# EAGLE design csc (EAGLE 6.1)
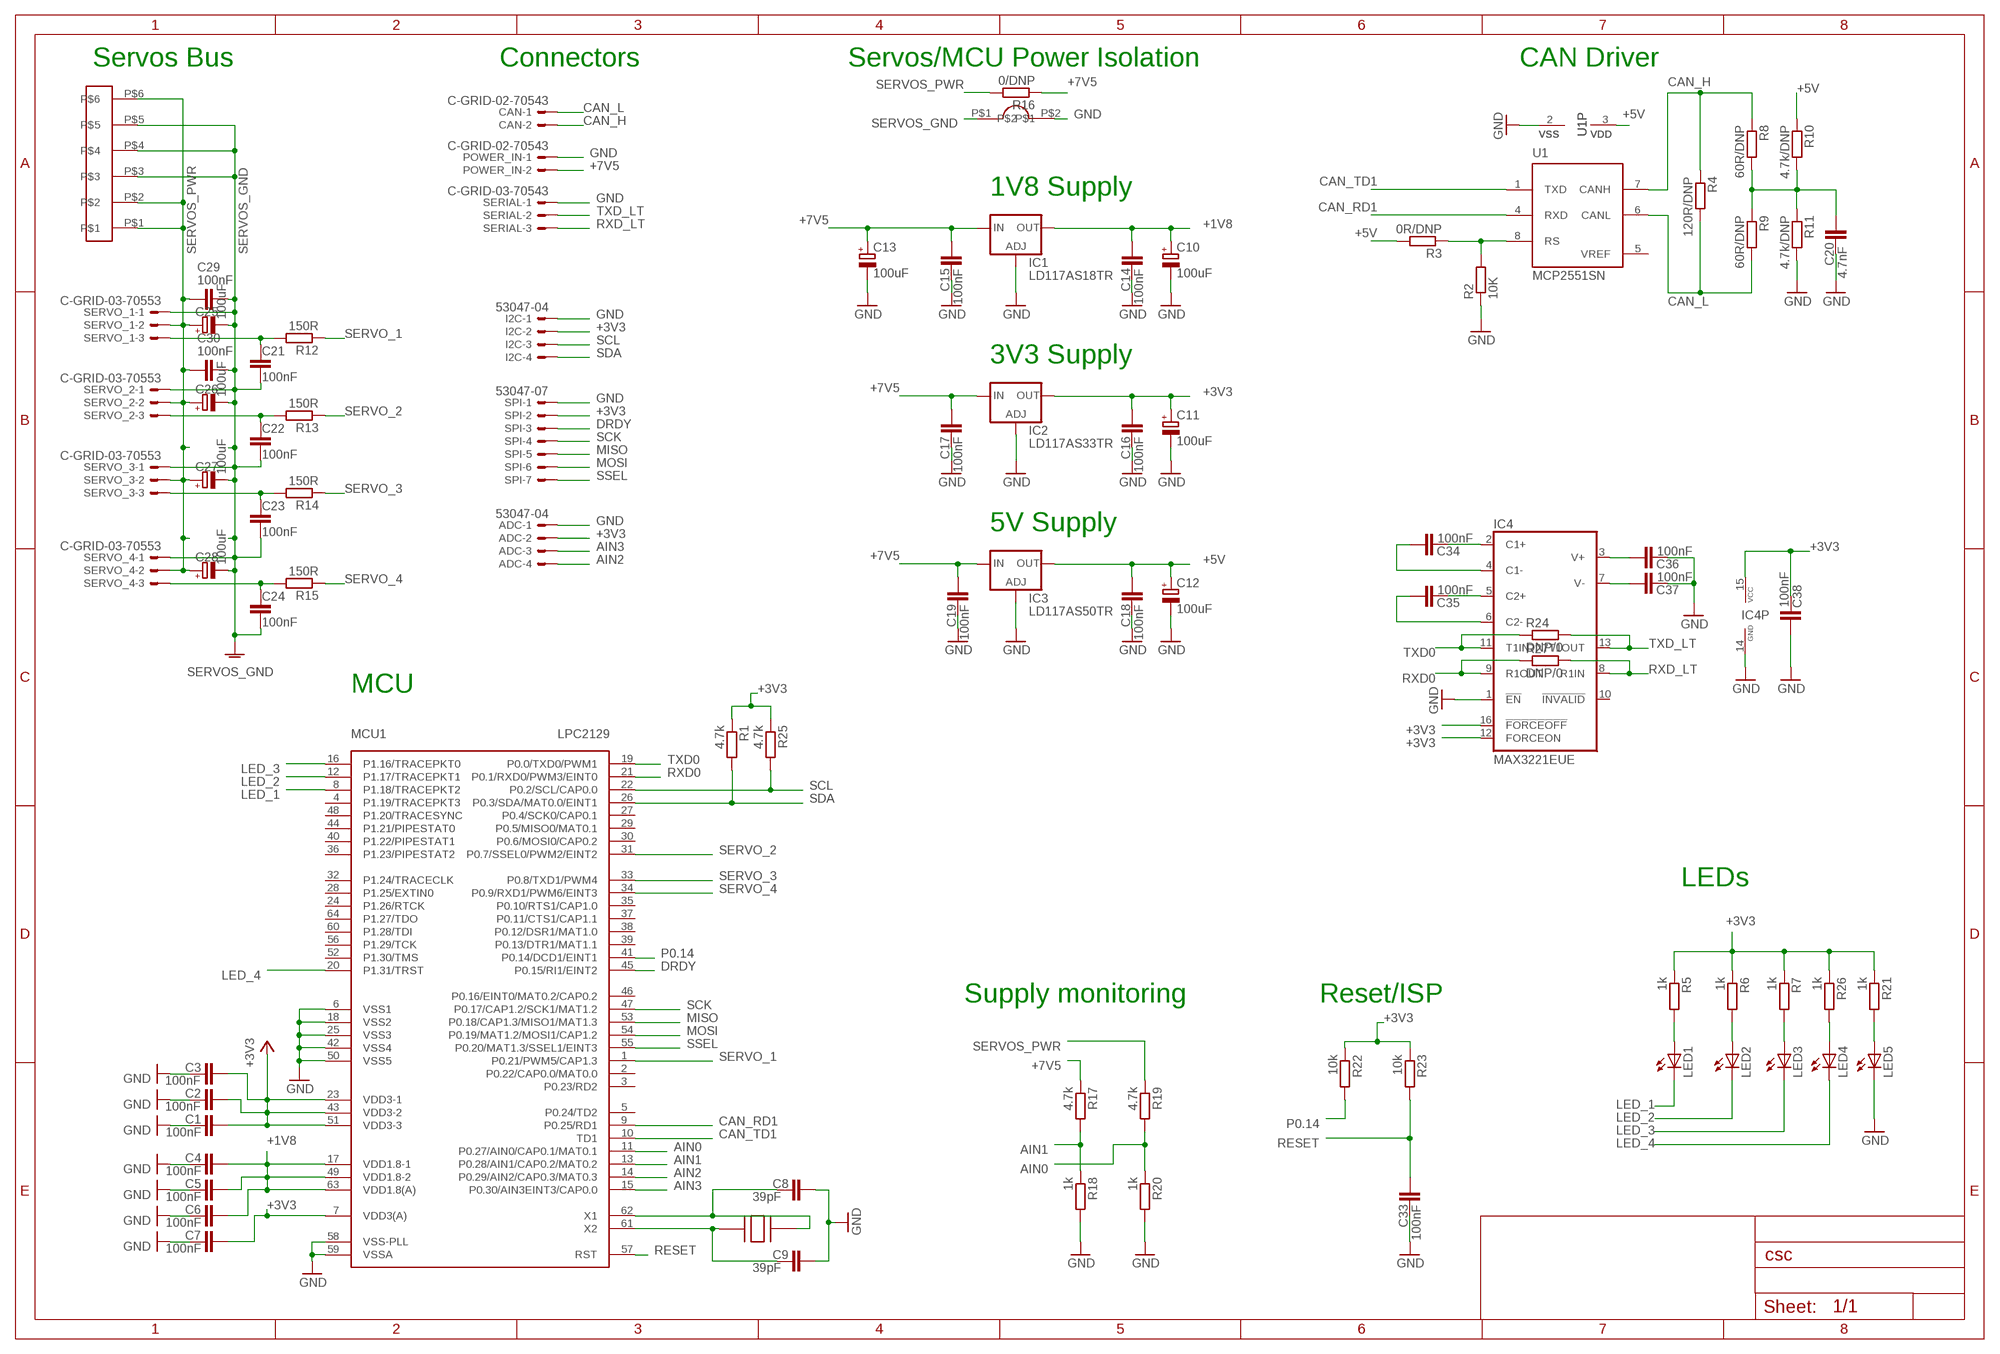
[diagram p0: schematic, sheet 1]

## Parts
ADC  53047-04  [53047-04]
C1  100nF  C-EUC0603K  [C0603K]
C2  100nF  C-EUC0603K  [C0603K]
C3  100nF  C-EUC0603K  [C0603K]
C4  100nF  C-EUC0603K  [C0603K]
C5  100nF  C-EUC0603K  [C0603K]
C6  100nF  C-EUC0603K  [C0603K]
C7  100nF  C-EUC0603K  [C0603K]
C8  39pF  C-EUC0603K  [C0603K]
C9  39pF  C-EUC0603K  [C0603K]
C10  100uF  CPOL-EUCT6032  [CT6032]
C11  100uF  CPOL-EUCT6032  [CT6032]
C12  100uF  CPOL-EUCT6032  [CT6032]
C13  100uF  CPOL-EUCT7343  [CT7343]
C14  100nF  C-EUC0603K  [C0603K]
C15  100nF  C-EUC0603K  [C0603K]
C16  100nF  C-EUC0603K  [C0603K]
C17  100nF  C-EUC0603K  [C0603K]
C18  100nF  C-EUC0603K  [C0603K]
C19  100nF  C-EUC0603K  [C0603K]
C20  4.7nF  C-EUC0603K  [C0603K]
C21  100nF  C-EUC0603K  [C0603K]
C22  100nF  C-EUC0603K  [C0603K]
C23  100nF  C-EUC0603K  [C0603K]
C24  100nF  C-EUC0603K  [C0603K]
C25  100uF  CPOL-EUE/7260-38W  [E/7260-38W]
C26  100uF  CPOL-EUE/7260-38W  [E/7260-38W]
C27  100uF  CPOL-EUE/7260-38W  [E/7260-38W]
C28  100uF  CPOL-EUE/7260-38W  [E/7260-38W]
C29  100nF  C-EUC0603K  [C0603K]
C30  100nF  C-EUC0603K  [C0603K]
C33  100nF  C-EUC0603K  [C0603K]
C34  100nF  C-EUC0603K  [C0603K]
C35  100nF  C-EUC0603K  [C0603K]
C36  100nF  C-EUC0603K  [C0603K]
C37  100nF  C-EUC0603K  [C0603K]
C38  100nF  C-EUC0603K  [C0603K]
CAN  C-GRID-02-70543  [70543-02]
I2C  53047-04  [53047-04]
IC1  LD117AS18TR  [SOT223]
IC2  LD117AS33TR  [SOT223]
IC3  LD117AS50TR  [SOT223]
IC4  MAX3221EUE  [TSSOP16]
LED1  LEDCHIP-LED0805  [CHIP-LED0805]
LED2  LEDCHIP-LED0805  [CHIP-LED0805]
LED3  LEDCHIP-LED0805  [CHIP-LED0805]
LED4  LEDCHIP-LED0805  [CHIP-LED0805]
LED5  LEDCHIP-LED0805  [CHIP-LED0805]
MCU1  LPC2129  [SQFP-S-10X10-64]
POWER_IN  C-GRID-02-70543  [70543-02]
R1  4.7k  R-EU_R0603  [R0603]
R2  10K  R-EU_R0603  [R0603]
R3  0R/DNP  R-EU_R0603  [R0603]
R4  120R/DNP  R-EU_R0603  [R0603]
R5  1k  R-EU_R0603  [R0603]
R6  1k  R-EU_R0603  [R0603]
R7  1k  R-EU_R0603  [R0603]
R8  60R/DNP  R-EU_R0603  [R0603]
R9  60R/DNP  R-EU_R0603  [R0603]
R10  4.7k/DNP  R-EU_R0603  [R0603]
R11  4.7k/DNP  R-EU_R0603  [R0603]
R12  150R  R-EU_R0603  [R0603]
R13  150R  R-EU_R0603  [R0603]
R14  150R  R-EU_R0603  [R0603]
R15  150R  R-EU_R0603  [R0603]
R16  0/DNP  R-EU_R0603  [R0603]
R17  4.7k  R-EU_R0603  [R0603]
R18  1k  R-EU_R0603  [R0603]
R19  4.7k  R-EU_R0603  [R0603]
R20  1k  R-EU_R0603  [R0603]
R21  1k  R-EU_R0603  [R0603]
R22  10k  R-EU_R0603  [R0603]
R23  10k  R-EU_R0603  [R0603]
R24  DNP/0  R-EU_R0603  [R0603]
R25  4.7k  R-EU_R0603  [R0603]
R26  1k  R-EU_R0603  [R0603]
R27  DNP/0  R-EU_R0603  [R0603]
SERIAL  C-GRID-03-70543  [70543-03]
SERVO_1  C-GRID-03-70553  [70553-03]
SERVO_2  C-GRID-03-70553  [70553-03]
SERVO_3  C-GRID-03-70553  [70553-03]
SERVO_4  C-GRID-03-70553  [70553-03]
SPI  53047-07  [53047-07]
U1  MCP2551SN  [SO-08]
U$1  CRYSTAL_CTS  [CTS_CRYSTAL]
U$2  CON_MPX  [CON_MPX]
U$3  NULL_DEV  [NULL_DEV]

## Nets
+1V8: C4.2 C5.2 C6.2 C10.+ C14.2 IC1.4(OUT) MCU1.17(VDD1.8-1) MCU1.49(VDD1.8-2) MCU1.63(VDD1.8(A))
+3V3: ADC.2 C1.2 C2.2 C3.2 C7.2 C11.+ C16.2 C38.1 I2C.2 IC2.4(OUT) IC4.12(FORCEON) IC4.15(VCC) IC4.16(!FORCEOFF) MCU1.7(VDD3(A)) MCU1.23(VDD3-1) MCU1.43(VDD3-2) MCU1.51(VDD3-3) R1.1 R5.1 R6.1 R7.1 R21.1 R22.1 R23.1 R25.1 R26.1 SPI.2
+5V: C12.+ C18.2 IC3.4(OUT) R3.2 R10.1 U1.3(VDD)
+7V5: C13.+ C15.2 C17.2 C19.2 IC1.3(IN) IC2.3(IN) IC3.3(IN) POWER_IN.2 R16.1 R17.1
AIN0: MCU1.11(P0.27/AIN0/CAP0.1/MAT0.1) R19.2 R20.1
AIN1: MCU1.13(P0.28/AIN1/CAP0.2/MAT0.2) R17.2 R18.1
AIN2: ADC.4 MCU1.14(P0.29/AIN2/CAP0.3/MAT0.3)
AIN3: ADC.3 MCU1.15(P0.30/AIN3EINT3/CAP0.0)
CAN_H: CAN.2 R4.1 R8.1 U1.7(CANH)
CAN_L: CAN.1 R4.2 R9.2 U1.6(CANL)
CAN_RD1: MCU1.9(P0.25/RD1) U1.4(RXD)
CAN_TD1: MCU1.10(TD1) U1.1(TXD)
DRDY: MCU1.45(P0.15/RI1/EINT2) SPI.3
GND: ADC.1 C1.1 C2.1 C3.1 C4.1 C5.1 C6.1 C7.1 C8.2 C9.2 C10.- C11.- C12.- C13.- C14.1 C15.1 C16.1 C17.1 C18.1 C19.1 C20.1 C33.1 C36.1 C37.1 C38.2 I2C.1 IC1.1(ADJ) IC2.1(ADJ) IC3.1(ADJ) IC4.1(!EN) IC4.14(GND) LED5.C MCU1.6(VSS1) MCU1.18(VSS2) MCU1.25(VSS3) MCU1.42(VSS4) MCU1.50(VSS5) MCU1.58(VSS-PLL) MCU1.59(VSSA) POWER_IN.1 R2.1 R11.2 R18.2 R20.2 SERIAL.1 SPI.1 U1.2(VSS) U$3.P$2
LED_1: LED1.C MCU1.8(P1.18/TRACEPKT2)
LED_2: LED2.C MCU1.12(P1.17/TRACEPKT1)
LED_3: LED3.C MCU1.16(P1.16/TRACEPKT0)
LED_4: LED4.C MCU1.20(P1.31/TRST)
MISO: MCU1.53(P0.18/CAP1.3/MISO1/MAT1.3) SPI.5
MOSI: MCU1.54(P0.19/MAT1.2/MOSI1/CAP1.2) SPI.6
N$1: C8.1 MCU1.62(X1) U$1.P$1
N$2: C9.1 MCU1.61(X2) U$1.P$3
N$3: R2.2 R3.1 U1.8(RS)
N$5: LED1.A R5.2
N$6: LED2.A R6.2
N$7: LED3.A R7.2
N$10: LED5.A R21.2
N$11: C20.2 R8.2 R9.1 R10.2 R11.1
N$12: C21.2 R12.2 SERVO_1.3
N$13: C22.2 R13.2 SERVO_2.3
N$14: C23.2 R14.2 SERVO_3.3
N$15: C24.2 R15.2 SERVO_4.3
N$16: C34.1 IC4.2(C1+)
N$17: LED4.A R26.2
N$18: C34.2 IC4.4(C1-)
N$19: C35.1 IC4.5(C2+)
N$20: C35.2 IC4.6(C2-)
N$26: C36.2 IC4.3(V+)
N$27: C37.2 IC4.7(V-)
P0.14: MCU1.41(P0.14/DCD1/EINT1) R22.2
RESET: C33.2 MCU1.57(RST) R23.2
RXD0: IC4.9(R1OUT) MCU1.21(P0.1/RXD0/PWM3/EINT0) R27.1
RXD_LT: IC4.8(R1IN) R27.2 SERIAL.3
SCK: MCU1.47(P0.17/CAP1.2/SCK1/MAT1.2) SPI.4
SCL: I2C.3 MCU1.22(P0.2/SCL/CAP0.0) R25.2
SDA: I2C.4 MCU1.26(P0.3/SDA/MAT0.0/EINT1) R1.2
SERVO_1: MCU1.1(P0.21/PWM5/CAP1.3) R12.1
SERVO_2: MCU1.31(P0.7/SSEL0/PWM2/EINT2) R13.1
SERVO_3: MCU1.33(P0.8/TXD1/PWM4) R14.1
SERVO_4: MCU1.34(P0.9/RXD1/PWM6/EINT3) R15.1
SERVOS_GND: C21.1 C22.1 C23.1 C24.1 C25.- C26.- C27.- C28.- C29.1 C30.1 SERVO_1.1 SERVO_2.1 SERVO_3.1 SERVO_4.1 U$2.P$3 U$2.P$4 U$2.P$5 U$3.P$1
SERVOS_PWR: C25.+ C26.+ C27.+ C28.+ C29.2 C30.2 R16.2 R19.1 SERVO_1.2 SERVO_2.2 SERVO_3.2 SERVO_4.2 U$2.P$1 U$2.P$2 U$2.P$6
SSEL: MCU1.55(P0.20/MAT1.3/SSEL1/EINT3) SPI.7
TXD0: IC4.11(T1IN) MCU1.19(P0.0/TXD0/PWM1) R24.1
TXD_LT: IC4.13(T1OUT) R24.2 SERIAL.2
Unconnected: IC4.10(!INVALID) MCU1.2(P0.22/CAP0.0/MAT0.0) MCU1.3(P0.23/RD2) MCU1.4(P1.19/TRACEPKT3) MCU1.5(P0.24/TD2) MCU1.24(P1.26/RTCK) MCU1.27(P0.4/SCK0/CAP0.1) MCU1.28(P1.25/EXTIN0) MCU1.29(P0.5/MISO0/MAT0.1) MCU1.30(P0.6/MOSI0/CAP0.2) MCU1.32(P1.24/TRACECLK) MCU1.35(P0.10/RTS1/CAP1.0) MCU1.36(P1.23/PIPESTAT2) MCU1.37(P0.11/CTS1/CAP1.1) MCU1.38(P0.12/DSR1/MAT1.0) MCU1.39(P0.13/DTR1/MAT1.1) MCU1.40(P1.22/PIPESTAT1) MCU1.44(P1.21/PIPESTAT0) MCU1.46(P0.16/EINT0/MAT0.2/CAP0.2) MCU1.48(P1.20/TRACESYNC) MCU1.52(P1.30/TMS) MCU1.56(P1.29/TCK) MCU1.60(P1.28/TDI) MCU1.64(P1.27/TDO)

## Notes on the sheet
- Servos Bus | Connectors | Servos/MCU Power Isolation | CAN Driver
- 1V8 Supply
- 3V3 Supply
- 5V Supply
- MCU
- LEDs
- Supply monitoring | Reset/ISP

## Power pins joined to a net without a drawn wire
VREF: U1.5(VREF)

## Library data of the parts
ADC I2C = con-molex:53?-04: CONNECTOR wire to board 1.25 mm (.049 inch) pitch header
C1-C9 C14-C24 C29 C30 C33-C38 = rcl:C-EU: CAPACITOR, European symbol
C10-C13 C25-C28 = rcl:CPOL-EU: POLARIZED CAPACITOR, European symbol
CAN POWER_IN = con-molex:C-GRID-02: CONNECTOR wire to board 2.54 mm (0.100") pitch header
IC1-IC3 = v-reg:LD117A?*: Low drop fixed and adjustable positive voltage regulators 1 A Source: http://www.st.com/stonline/products/literature/ds/7194/ld1117axx.pdf
IC4 = maxim:MAX3221*: RS-232 Transceivers with AutoShutdown 1µA Supply-Current, True +3V to +5.5V http://dbserv.maxim-ic.com/
LED1-LED5 = led:LED: LED OSRAM: - CHIPLED LG R971, LG N971, LY N971, LG Q971, LY Q971, LO R971, LY R971 LH N974, LH R974 LS Q976, LO Q976, LY Q976 LO Q996 - Hyper CHIPLED LW Q18S LB Q993, LB Q99A, LB R99A - SideLED LS A670, LO A670, LY A670, LG A670, LP A670 LB A673, LV A673, LT A673, LW A673 LH A674 LY A675 LS A676, LA A676, LO A676, LY A676, LW A676 LS A679, LY A679, LG A679 - Hyper Micro SIDELED® LS Y876, LA Y876, LO Y876, LY Y876 LT Y87S - SmartLED LW L88C, LW L88S LB L89C, LB L89S, LG L890 LS L89K, LO L89K, LY L89K LS L896, LA L896, LO L896, LY L896 - TOPLED LS T670, LO T670, LY T670, LG T670, LP T670 LSG T670, LSP T670, LSY T670, LOP T670, LYG T670 LG T671, LOG T671, LSG T671 LB T673, LV T673, LT T673, LW T673 LH T674 LS T676, LA T676, LO T676, LY T676, LB T676, LH T676, LSB T676, LW T676 LB T67C, LV T67C, LT T67C, LS T67K, LO T67K, LY T67K, LW E67C LS E67B, LA E67B, LO E67B, LY E67B, LB E67C, LV E67C, LT E67C LW T67C LS T679, LY T679, LG T679 LS T770, LO T770, LY T770, LG T770, LP T770 LB T773, LV T773, LT T773, LW T773 LH T774 LS E675, LA E675, LY E675, LS T675 LS T776, LA T776, LO T776, LY T776, LB T776 LHGB T686 LT T68C, LB T68C - Hyper Mini TOPLED® LB M676 - Mini TOPLED Santana® LG M470 LS M47K, LO M47K, LY M47K Source: http://www.osram.convergy.de LUXEON: - LUMILED® LXK2-PW12-R00, LXK2-PW12-S00, LXK2-PW14-U00, LXK2-PW14-V00 LXK2-PM12-R00, LXK2-PM12-S00, LXK2-PM14-U00 LXK2-PE12-Q00, LXK2-PE12-R00, LXK2-PE12-S00, LXK2-PE14-T00, LXK2-PE14-U00 LXK2-PB12-K00, LXK2-PB12-L00, LXK2-PB12-M00, LXK2-PB14-N00, LXK2-PB14-P00, LXK2-PB14-Q00 LXK2-PR12-L00, LXK2-PR12-M00, LXK2-PR14-Q00, LXK2-PR14-R00 LXK2-PD12-Q00, LXK2-PD12-R00, LXK2-PD12-S00 LXK2-PH12-R00, LXK2-PH12-S00 LXK2-PL12-P00, LXK2-PL12-Q00, LXK2-PL12-R00 Source: www.luxeon.com KINGBRIGHT: KA-3528ASYC Source: www.kingbright.com
MCU1 = paparazzi:LPC2129
R1-R27 = rcl:R-EU_: RESISTOR, European symbol
SERIAL SERVO_1-SERVO_4 = con-molex:C-GRID-03: CONNECTOR wire to board 2.54 mm (0.100") pitch header
SPI = con-molex:53?-07: CONNECTOR wire to board 1.25 mm (.049 inch) pitch header
U1 = microchip_can:MCP2551: High Speed CAN tranceiver
U$1 = paparazzi:CRYSTAL_CTS
U$2 = booz:CON_MPX
U$3 = booz:NULL_DEV

## Board
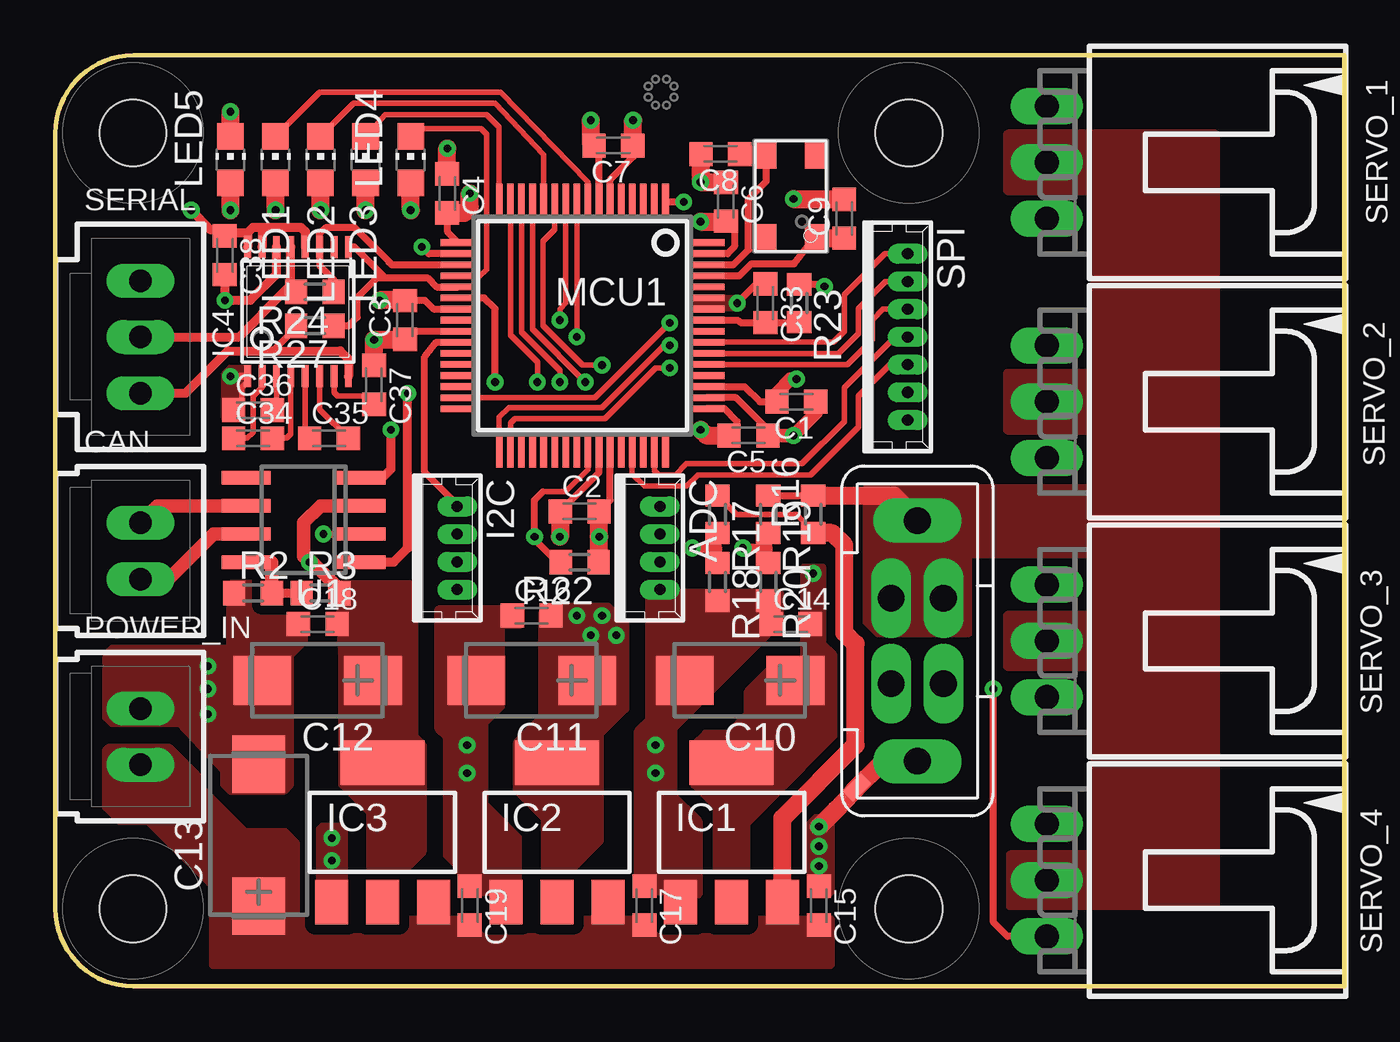
[diagram p1: board, top side]
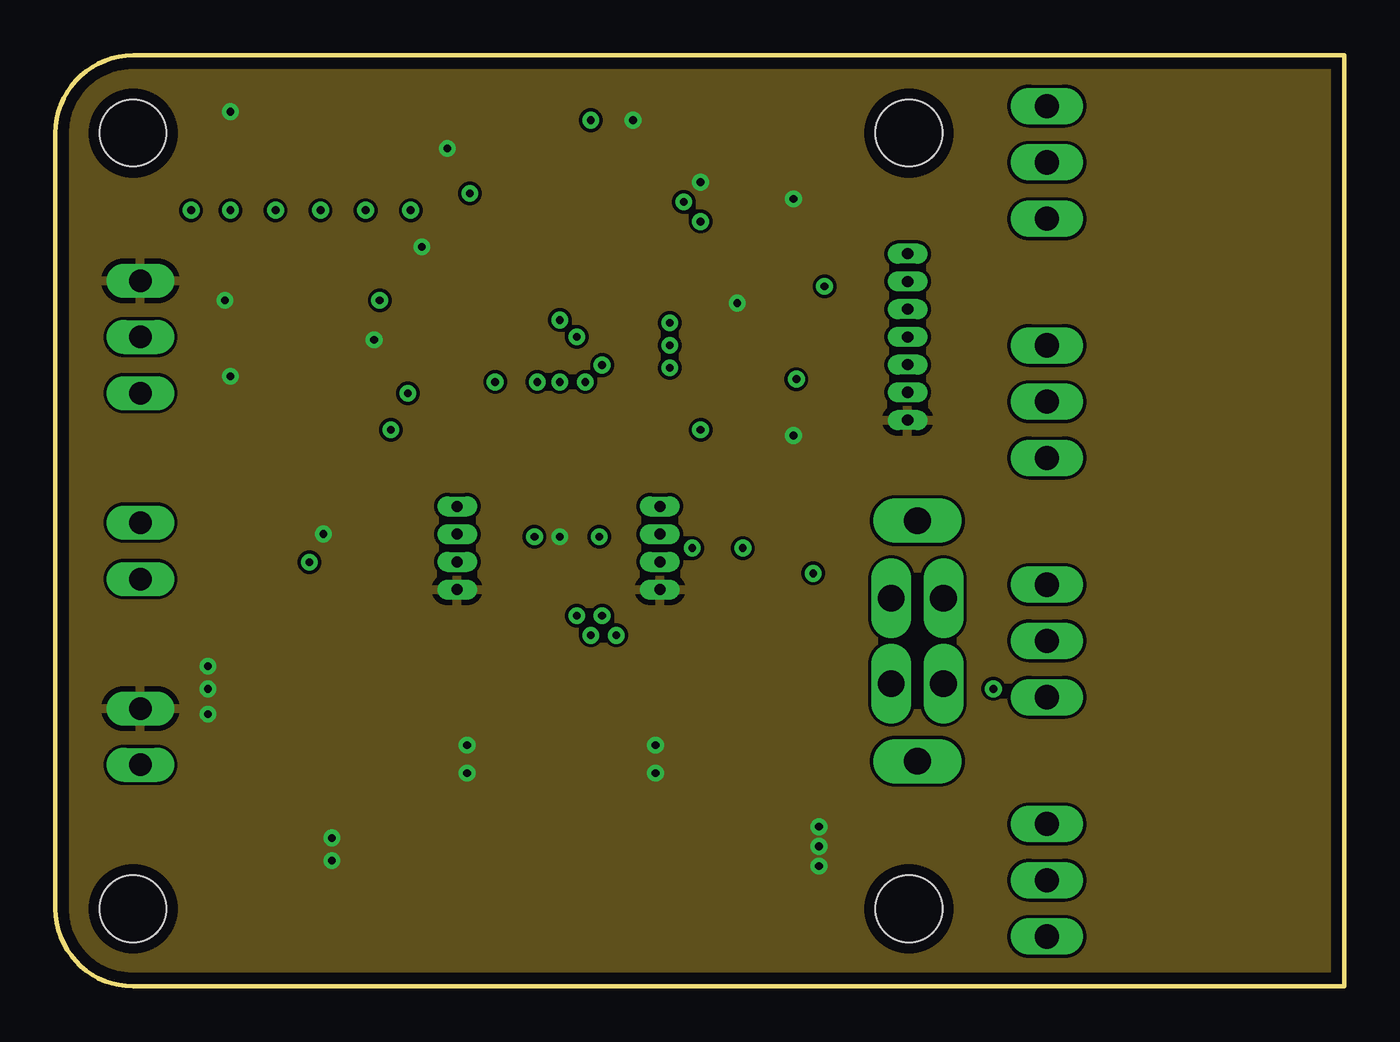
[diagram p2: board, inner layer Route2]
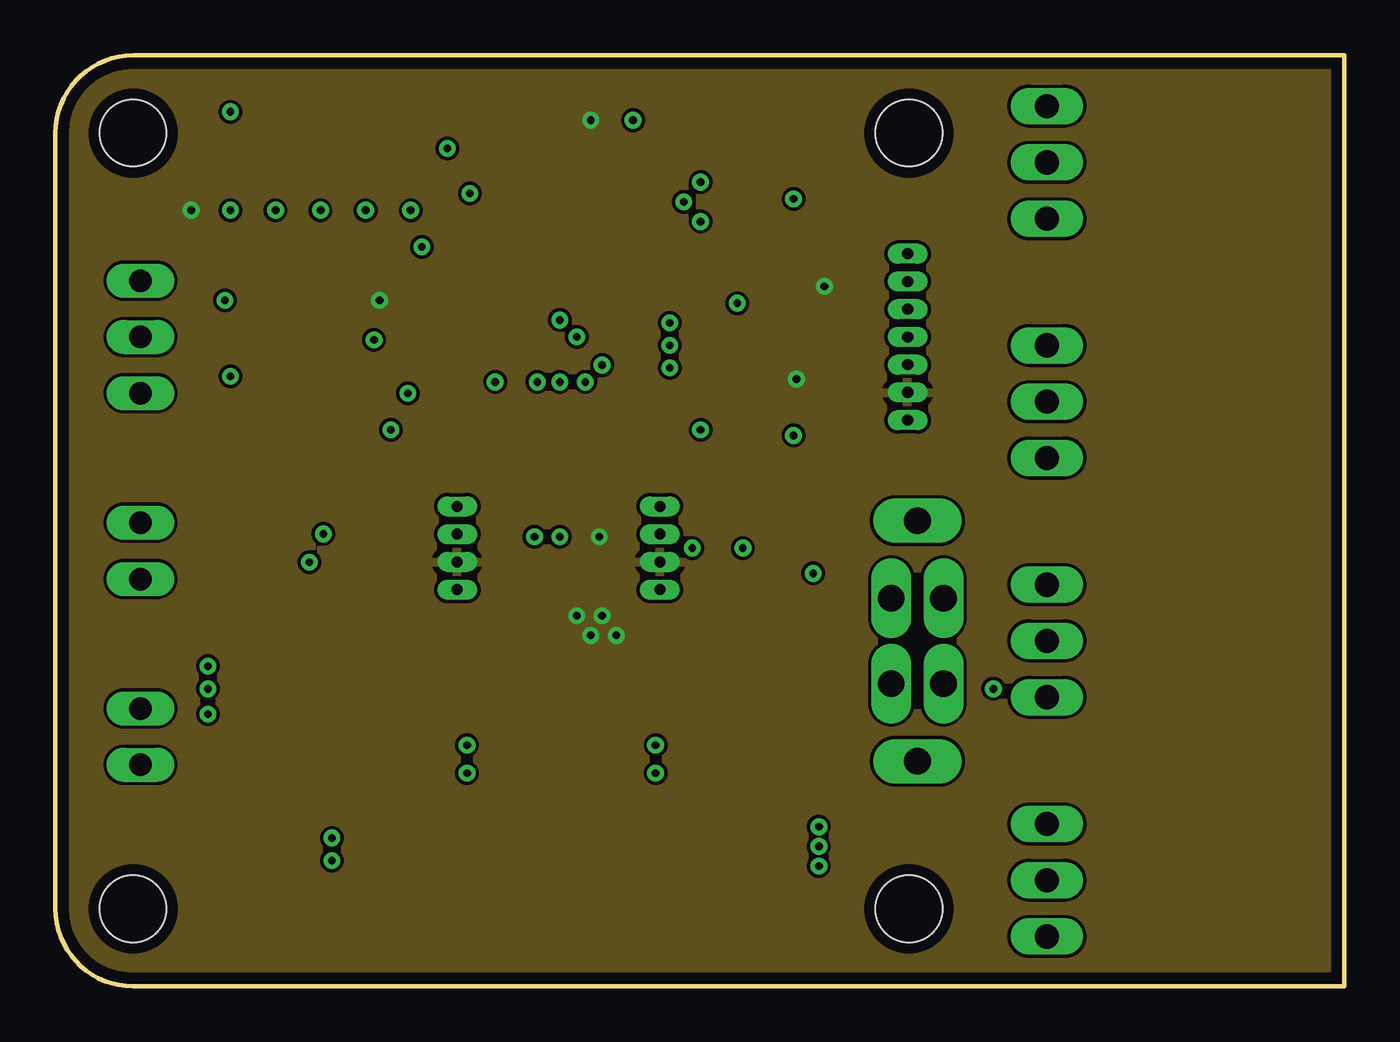
[diagram p3: board, inner layer Route15]
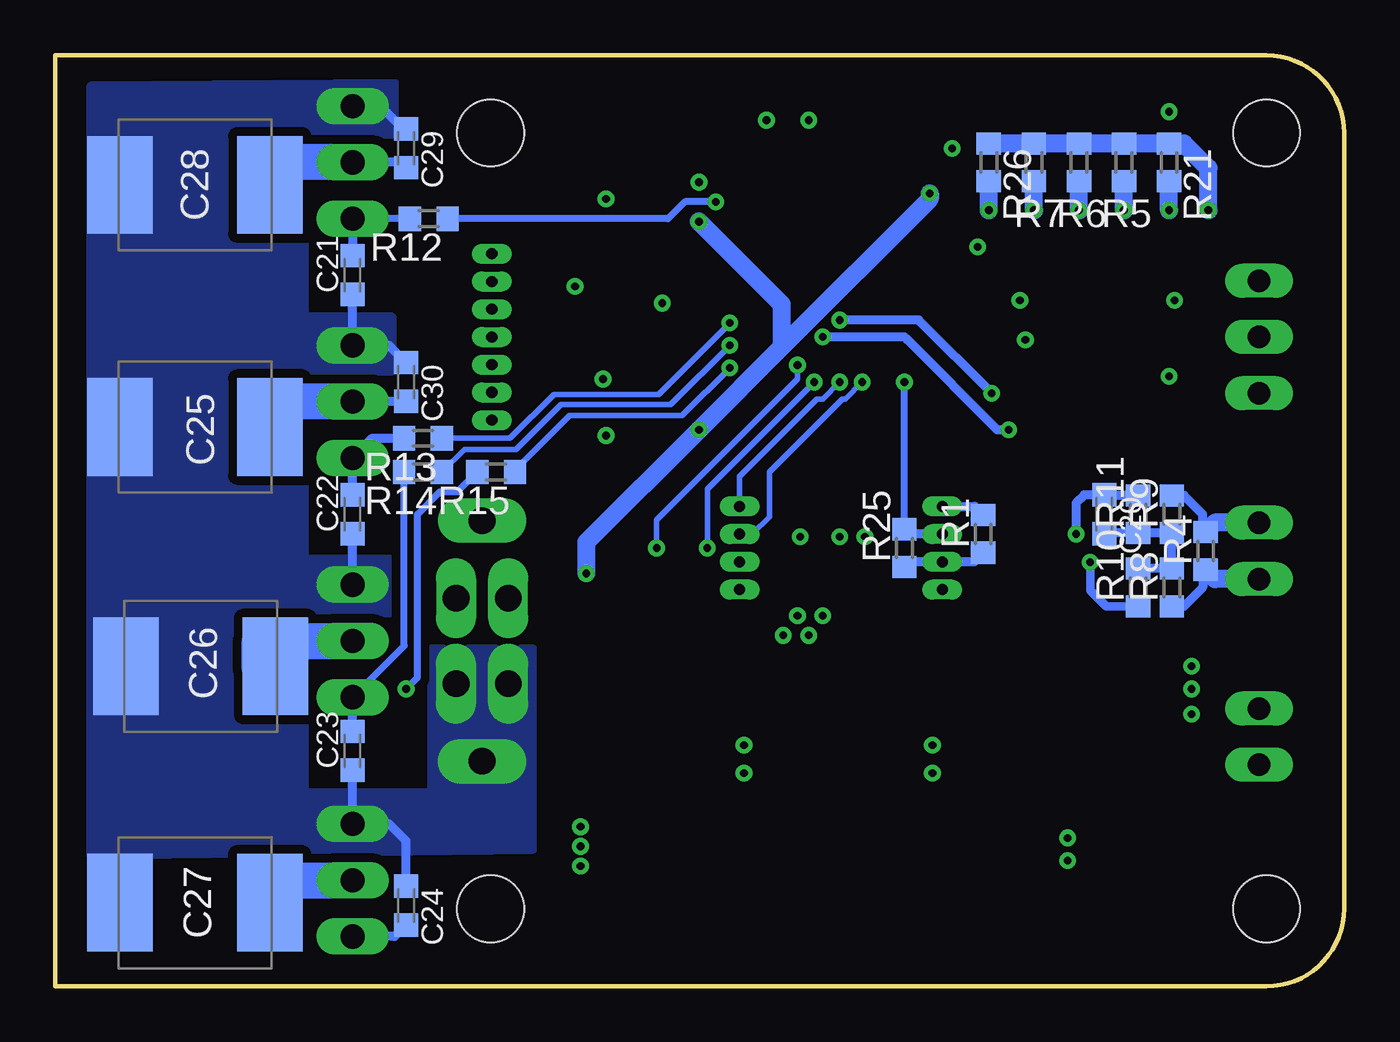
[diagram p4: board, bottom side, seen from below]

Size 58.13 x 42 mm. Coordinates in mm from the lower left corner, seen from the top.
Outline: 3.5,42 58.13,42 58.13,0 3.5,0 arc-90 0,3.5 0,38.5 arc-90 3.5,42
Copper layers (1+2*15+16): Top 0.0178mm / dielectric 12mil / Route2 0.0356mm / dielectric 28mil / Route15 0.0356mm / dielectric 12mil / Bottom 0.0178mm
Design rules: minimum track width 6mil, minimum drill 8mil, track to track 6mil, track to pad 6mil, pad to pad 6mil, via to via 6mil, smd to smd 6mil, copper to edge 20mil, drill to drill 16mil, minimum pad ring 8mil, minimum via ring 8mil, stop-mask expansion 3mil, vias tented up to drill 0.36mm, thermal gap 10mil
Holes 3 mm at 3.5,38.5 3.5,3.5 38.5,38.5 38.5,3.5
tKeepout: area 0,35 to 7,42; area 0,0 to 7,7; area 35,35 to 42,42; area 35,0 to 42,7

### Footprints (pad centres in the part's own frame; a part is rotated, then mirrored left to right if it is on the bottom)
53047-04 = drill 0.5 pad 0.698 long: 1 1.875,0.45; 2 0.625,0.45; 3 -0.625,0.45; 4 -1.875,0.45
C0603K = smd 1.05 x 1.08: 1 -0.875,0; 2 0.875,0
CT6032 = smd 2.6 x 2.2: + -2.5,0; - 2.5,0
CT7343 = smd 2.6 x 2.4: + -3.2,0; - 3.2,0
E/7260-38W = smd 2.95 x 4.4: + 3.375,0; - -3.375,0
70543-02 = drill 1.016 long: 1 -1.27,0; 2 1.27,0
SOT223 = smd 1.5 x 2: 1 -2.3,-3.15; 2 0,-3.15; 3 2.3,-3.15 | smd 3.8 x 2: 4 0,3.15
TSSOP16 = smd 0.305 x 0.991: 1 -2.275,-2.918; 2 -1.625,-2.918; 3 -0.975,-2.918; 4 -0.325,-2.918; 5 0.325,-2.918; 6 0.975,-2.918; 7 1.625,-2.918; 8 2.275,-2.918; 9 2.275,2.918; 10 1.625,2.918; 11 0.975,2.918; 12 0.325,2.918; 13 -0.325,2.918; 14 -0.975,2.918; 15 -1.625,2.918; 16 -2.275,2.918
CHIP-LED0805 = smd 1.2 x 1.2: A 0,-1.05; C 0,1.05
SQFP-S-10X10-64 = smd 0.3 x 1.6: 1 -3.75,-5.6; 2 -3.25,-5.6; 3 -2.75,-5.6; 4 -2.25,-5.6; 5 -1.75,-5.6; 6 -1.25,-5.6; 7 -0.75,-5.6; 8 -0.25,-5.6; 9 0.25,-5.6; 10 0.75,-5.6; 11 1.25,-5.6; 12 1.75,-5.6; 13 2.25,-5.6; 14 2.75,-5.6; 15 3.25,-5.6; 16 3.75,-5.6; 33 3.75,5.6; 34 3.25,5.6; 35 2.75,5.6; 36 2.25,5.6; 37 1.75,5.6; 38 1.25,5.6; 39 0.75,5.6; 40 0.25,5.6; 41 -0.25,5.6; 42 -0.75,5.6; 43 -1.25,5.6; 44 -1.75,5.6; 45 -2.25,5.6; 46 -2.75,5.6; 47 -3.25,5.6; 48 -3.75,5.6 | smd 1.6 x 0.3: 17 5.6,-3.75; 18 5.6,-3.25; 19 5.6,-2.75; 20 5.6,-2.25; 21 5.6,-1.75; 22 5.6,-1.25; 23 5.6,-0.75; 24 5.6,-0.25; 25 5.6,0.25; 26 5.6,0.75; 27 5.6,1.25; 28 5.6,1.75; 29 5.6,2.25; 30 5.6,2.75; 31 5.6,3.25; 32 5.6,3.75; 49 -5.6,3.75; 50 -5.6,3.25; 51 -5.6,2.75; 52 -5.6,2.25; 53 -5.6,1.75; 54 -5.6,1.25; 55 -5.6,0.75; 56 -5.6,0.25; 57 -5.6,-0.25; 58 -5.6,-0.75; 59 -5.6,-1.25; 60 -5.6,-1.75; 61 -5.6,-2.25; 62 -5.6,-2.75; 63 -5.6,-3.25; 64 -5.6,-3.75
R0603 = smd 1 x 1.1: 1 -0.85,0; 2 0.85,0
70543-03 = drill 1.016 long: 1 -2.54,0; 2 0,0; 3 2.54,0
70553-03 = drill 1.092 long: 1 -2.54,-7.62; 2 0,-7.62; 3 2.54,-7.62
53047-07 = drill 0.5 pad 0.698 long: 1 3.75,0.45; 2 2.5,0.45; 3 1.25,0.45; 4 0,0.45; 5 -1.25,0.45; 6 -2.5,0.45; 7 -3.75,0.45
SO-08 = smd 0.6 x 2.2: 1 -1.905,-2.6; 2 -0.635,-2.6; 3 0.635,-2.6; 4 1.905,-2.6; 5 1.905,2.6; 6 0.635,2.6; 7 -0.635,2.6; 8 -1.905,2.6
CTS_CRYSTAL = smd 1.2 x 0.9: P$1 -1.85,-1.1; P$2 1.85,-1.1; P$3 1.85,1.1; P$4 -1.85,1.1
CON_MPX = drill 1.2 pad 2 long: P$1 5.425,0; P$4 -5.425,0 | drill 1.2 pad 1.7 long: P$2 1.925,1.175; P$3 -1.925,1.175; P$5 -1.925,-1.175; P$6 1.925,-1.175
NULL_DEV = smd 0.635 x 0.635: P$1 -0.254,0; P$2 0.254,0

### Placement (x,y rotation side)
ADC  26.82,19.77 270 top
C1  33.42,26.38 180 top
C2  23.65,21.42 0 top
C3  15.77,30.06 90 top
C4  17.68,35.77 270 top
C5  31.27,24.85 180 top
C6  30.25,35.39 270 top
C7  25.17,37.93 180 top
C8  30,37.55 180 top
C9  35.58,34.63 90 top
C10  30.88,13.8 180 top
C11  21.49,13.8 180 top
C12  11.84,13.8 180 top
C13  9.17,6.82 90 top
C14  33.17,16.34 0 top
C15  34.44,3.64 270 top
C16  21.49,16.73 0 top
C17  26.57,3.64 270 top
C18  11.84,16.34 0 top
C19  18.69,3.64 270 top
C20  10.82,21.3 270 bottom
C21  44.73,32.09 90 bottom
C22  44.73,21.3 90 bottom
C23  44.73,10.63 90 bottom
C24  42.31,3.64 270 bottom
C25  51.84,25.23 0 bottom
C26  51.59,14.44 0 bottom
C27  51.84,3.77 0 bottom
C28  51.84,36.16 0 bottom
C29  42.31,37.81 270 bottom
C30  42.31,27.27 270 bottom
C33  32.03,30.82 270 top
C34  8.91,24.73 0 top
C35  12.34,24.73 0 top
C36  8.91,26 0 top
C37  14.38,27.14 270 top
C38  7.64,32.98 270 top
CAN  3.83,19.65 270 top
I2C  17.68,19.77 270 top
IC1  30.5,6.95 0 top
IC2  22.63,6.95 0 top
IC3  14.76,6.95 0 top
IC4  10.95,30.44 0 top
LED1  9.93,37.3 0 top
LED2  11.96,37.3 0 top
LED3  13.99,37.3 0 top
LED4  16.03,37.3 0 top
LED5  7.9,37.3 0 top
MCU1  23.77,29.81 180 top
POWER_IN  3.83,11.26 270 top
R1  16.28,20.41 90 bottom
R2  8.91,17.74 0 top
R3  11.96,17.74 0 top
R4  6.25,19.65 90 bottom
R5  9.93,37.17 270 bottom
R6  11.96,37.17 270 bottom
R7  13.99,37.17 270 bottom
R8  7.77,18 90 bottom
R9  7.77,21.3 90 bottom
R10  9.29,18 90 bottom
R11  9.29,21.3 90 bottom
R12  41.3,34.63 180 bottom
R13  41.55,24.73 180 bottom
R14  41.55,23.2 180 bottom
R15  38.25,23.2 180 bottom
R16  34.19,21.3 90 top
R17  29.87,21.3 270 top
R18  29.87,18.25 270 top
R19  32.16,21.3 270 top
R20  32.16,18.25 270 top
R21  7.9,37.17 270 bottom
R22  23.65,19.14 180 top
R23  33.55,30.82 270 top
R24  11.71,31.33 180 top
R25  19.84,19.77 90 bottom
R26  16.03,37.17 270 bottom
R27  11.71,29.81 180 top
SERIAL  3.83,29.3 270 top
SERVO_1  52.35,37.17 270 top
SERVO_2  52.35,26.38 270 top
SERVO_3  52.35,15.58 270 top
SERVO_4  52.35,4.79 270 top
SPI  38,29.3 270 top
U1  11.2,21.04 90 top
U$1  33.17,35.65 270 top
U$2  38.89,15.58 90 top
U$3  36.17,8.98 45 top

### Tracks (layer width: path | path; a pad name or v marks a point on that pad's centre or on a via)
+1V8  (via drill 0.35)
  Top 0.305: MCU1.63 30.32,33.06 30.63,33.36 30.63,34.25 C6.2 | C10.+ 34.06,13.83 | MCU1.49 30.19,26.06 30.76,25.49 30.76,25.22 C5.2 | MCU1.17 17.68,34.05 C4.2
  Top 0.813: v29.11,25.11 29.36,24.85 C5.2 | v18.69,35.77 18.69,35.14 18.45,34.9 C4.2 | C6.2 30.24,34.51 v29.11,34.51
  Bottom 0.813: 25.36,28.85 18.69,35.52 v18.69,35.77 | 25.36,28.85 v29.11,25.11 34.19,20.03 v34.19,18.63 | v29.11,34.51 25.36,30.76 25.36,28.85
  pour Top (isolate 0.406, no thermals): 29.87,3.9 29.87,8.09 28.85,9.11 28.85,10.88 29.36,11.39 30.38,11.39 31.27,12.28 31.27,13.3 32.16,14.18 32.28,14.31 32.28,14.69 33.81,14.69 33.81,18.88 34.57,18.88 34.57,15.45 35.08,14.95 35.08,11.26 31.14,7.33 31.14,3.9
+3V3  (via drill 0.35)
  Top 0.305: 9.29,34.25 9.32,34.23 | 7.67,34.01 C38.1 7.52,34.12 | v34.7,31.58 34.61,31.67 R23.1 | MCU1.7 24.52,37.71 C7.2 | MCU1.43 25.02,21.93 C2.2 | MCU1.51 31.09,27.06 31.77,26.38 C1.2 | MCU1.23 17.05,30.56 16.66,30.95 15.91,30.95 C3.2 15.89,30.95 | v24.54,20.28 24.54,20.15
  Top 0.406: IC4.12 11.27,34.05 11.07,34.25 9.29,34.25 8.91,34.25 8.67,34.01 | 8.67,34.01 IC4.16 | 9.32,34.23 IC4.15 | 7.67,34.01 8.67,34.01 | 7.52,34.12 7.01,34.12 v6.12,35.01
  Top 0.61: v33.42,27.39 33.17,27.39 32.55,26.77 C1.2
  Top 0.813: v24.15,39.08 24.15,38.08 C7.2 | 15.89,30.95 v14.63,30.95 | C2.2 24.54,21.41 v24.54,20.28 24.54,19.18 R22.1
  Bottom 0.406: R1.1 16.69,19.15 I2C.2 19.61,19.15 R25.1
  Bottom 0.813: v6.12,35.01 6.12,36.92 7.22,38.02 R21.1 R5.1 R6.1 R7.1 R26.1
  other vias: 23.52,16.73 24.66,16.73 24.15,15.84 25.3,15.84
  pour Route15: -0.36,42 58.32,42 58.19,-0.42 -0.48,-0.42
  pour Top (isolate 0.406, no thermals): 22.12,4.28 22.12,7.58 20.85,8.85 20.85,11.01 22,12.15 22,16.85 22.25,17.11 24.92,17.11 25.68,16.34 25.68,12.53 24.54,11.39 24.54,6.56 23.14,5.17 23.14,4.28
+5V  (via drill 0.35)
  Top 0.61: U1.3 11.96,21.68 11.2,20.92 11.2,19.39 v11.45,19.14 11.58,19.14 12.81,17.91 R3.2
  Bottom 0.381: R10.1 10.73,17.14 11.45,17.87 v11.45,19.14
  pour Top (isolate 0.406, no thermals): 14.25,4.15 14.25,7.84 12.98,9.11 12.98,14.69 12.85,18.12 16.15,18.12 16.15,11.26 16.53,10.88 16.53,6.06 15.26,4.79 15.26,4.15
+7V5
  Top 0.254: R16.1 33.46,21.3 30.72,21.3 R17.1
  Top 0.813: R16.1 35.04,20.45 35.58,19.9 35.58,15.96 36.09,15.45 36.09,10.88 32.79,7.58 IC1.3
  pour Top (isolate 0.457, no thermals): 7.14,3.01 34.95,3.01 34.95,0.98 7.14,0.98
  pour Top (isolate 0.406, no thermals): 2.44,10.76 5.1,10.76 6.37,9.49 6.37,9.11 8.53,6.95 10.31,6.95 10.82,6.44 10.82,2.63 7.14,2.63 7.14,4.53 4.21,7.45 2.95,7.45 2.31,8.09 2.31,10.63
AIN0  (via drill 0.35)
  Top 0.254: MCU1.11 22.52,34.14 22,33.62 22,29.81 23.77,28.03 v24.66,28.03
  Top 0.406: 32.16,19.77 R20.1 | 32.16,19.77 R19.2 | v31.01,19.77 32.16,19.77
  Bottom 0.254: v31.01,19.77 31.01,21.04 24.66,27.39 v24.66,28.03
AIN1  (via drill 0.35)
  Top 0.254: MCU1.13 21.52,29.64 v23.9,27.27
  Top 0.406: 29.87,19.77 R18.1 | 29.87,19.77 R17.2 | v28.73,19.77 29.87,19.77
  Bottom 0.254: v23.9,27.27 28.73,22.44 v28.73,19.77
AIN2  (via drill 0.35)
  Top 0.254: MCU1.14 21.02,29.51 22.76,27.77 v22.76,27.27
  Bottom 0.254: ADC.4 27.27,23.01 23.77,26.5 23.52,26.5 v22.76,27.27
AIN3  (via drill 0.35)
  Top 0.254: MCU1.15 20.52,29.37 21.74,28.16 v21.74,27.27
  Bottom 0.254: ADC.3 26.7,20.4 25.93,21.17 25.93,23.2 22.63,26.5 22.5,26.5 v21.74,27.27
CAN_H
  Top 0.61: U1.7 7.14,20.41 5.1,18.38 CAN.2
  Bottom 0.406: R8.1 7.22,17.14 6.37,18 6.37,18.67 R4.1
  Bottom 0.813: R4.1 5.83,18.38 CAN.2
CAN_L
  Top 0.61: U1.6 4.6,21.68 CAN.1
  Bottom 0.406: R9.2 7.22,22.15 6.37,21.3 6.37,20.62 R4.2
  Bottom 0.813: R4.2 5.83,20.92 CAN.1
CAN_RD1  (via drill 0.35)
  Top 0.254: MCU1.9 v23.52,29.3
  Top 0.406: U1.4 14.76,22.95 15.14,23.33 v15.14,25.11
  Bottom 0.406: v15.14,25.11 15.64,25.11 19.71,29.17 19.84,29.3 v23.52,29.3
CAN_TD1  (via drill 0.35)
  Top 0.254: MCU1.10 23.02,30.82 22.76,30.56 v22.76,30.06
  Top 0.406: U1.1 15.26,19.14 15.9,19.77 v15.9,26.76
  Bottom 0.406: v15.9,26.76 19.2,30.06 v22.76,30.06
DRDY
  Top 0.254: SPI.3 37.64,28.05 36.22,26.63 36.22,25.23 34.06,23.07 28.98,23.07 28.47,22.57 26.57,22.57 26.02,23.11 MCU1.45
GND  (via drill 0.35)
  Top 0.254: IC4.1 8.67,27.28 8.41,27.01 8.41,26.36 C36.1
  Top 0.305: v12.09,20.41 U1.2 | IC4.1 v7.9,27.52 | MCU1.6 25.02,36.39 26.06,37.43 C7.1 | v30.76,30.82 31.63,31.7 C33.1 | MCU1.42 24.52,23.18 C2.1 22.59,21.24 | MCU1.50 30.71,26.56 32.14,25.12 C5.1 | MCU1.18 16.84,33.06 v16.53,33.36 | MCU1.25 16.27,29.56 C3.1
  Top 0.406: C38.2 v7.64,30.95 8.79,30.95 9.97,32.13 IC4.14
  Top 0.61: C5.1 v33.3,24.85 34.3,25.86 C1.1
  Top 0.813: C6.1 30.26,36.28 v29.11,36.28 29.11,37.67 C8.2 | v26.06,39.08 26.06,37.95 C7.1 | C4.1 v17.68,37.81 | C37.1 v14.38,29.17 15.89,29.17 C3.1 | C9.2 35.57,35.52 v33.3,35.52 | v22.76,20.28 22.76,21.41 C2.1 | LED5.C v7.9,39.46 | v34.44,7.2 35.2,7.96 U$3.P$2
  Bottom 0.406: R11.2 10.79,22.15 C20.1 11.72,22.17 12.09,21.8 v12.09,20.41
  other vias: 6.88,14.44 6.88,13.42 6.88,12.28 12.47,5.68 12.47,6.69 18.57,9.61 18.57,10.88 27.07,10.88 27.07,9.61 34.44,6.31 34.44,5.42
  pour Route2: -0.36,42.12 58.06,42.12 58.06,-0.04 -0.36,-0.04
  pour Top (no thermals): 28.73,31.08 30.88,31.08 31.01,30.95 31.01,30.7 30.88,30.57 28.73,30.57
  pour Top (no thermals): 7.64,25.61 7.64,27.65 7.9,27.9 8.66,27.9 8.66,27.27 8.41,27.01 8.41,25.61
  pour Top (isolate 0.406, no thermals): 2.56,11.9 5.61,11.9 7.64,9.74 7.64,9.11 7.9,8.85 10.31,8.85 10.56,9.11 10.56,14.95 11.2,15.58 11.2,16.73 9.04,16.73 9.04,18.12 7.9,18.12 7.9,15.2 2.56,15.2 2.31,14.95 2.31,12.15
  pour Top (isolate 0.406, no thermals): 11.96,3.9 11.96,7.07 12.09,7.2 12.85,7.2 12.98,7.07 12.98,3.9
  pour Top (isolate 0.406, no thermals): 20.85,4.15 20.85,6.69 19.33,8.22 19.33,11.9 20.09,12.66 20.09,16.34 20.98,16.34 20.98,16.98 17.3,16.98 17.3,11.64 17.68,11.26 17.68,5.93 18.31,5.29 18.31,4.53 18.57,4.28 19.84,4.28 19.84,4.15
  pour Top (isolate 0.406, no thermals): 28.98,4.15 27.71,4.15 27.71,4.28 26.31,4.28 26.31,11.52 26.82,12.03 26.82,17.74 31.9,17.74 32.66,17.74 32.66,16.47 27.84,11.64 27.84,8.6 28.98,7.45
  pour Top (isolate 0.457, no thermals): 34.06,7.58 34.95,7.58 34.95,4.28 34.82,4.15 34.06,4.15 34.06,5.04
LED_1
  Top 0.254: LED1.C 11.93,40.35 20.09,40.35 24.02,36.29 MCU1.8
LED_2
  Top 0.254: LED2.C 13.45,39.84 19.84,39.84 22.02,37.52 MCU1.12
LED_3
  Top 0.254: LED3.C 13.99,38.31 14.88,39.33 19.45,39.33 20.02,38.76 MCU1.16
LED_4
  Top 0.254: MCU1.20 19.16,32.06 19.45,32.35 19.45,38.44 19.2,38.7 16.5,38.7 LED4.C 16.25,38.22
MISO
  Top 0.254: SPI.5 37.34,30.55 36.85,30.06 36.85,29.17 35.74,28.06 MCU1.53
MOSI
  Top 0.254: MCU1.54 35.33,28.56 36.22,29.45 36.22,30.57 37.45,31.8 SPI.6
N$1
  Top 0.305: MCU1.62 30.59,32.56 31.27,33.23 31.27,35.52 32.07,36.33 U$1.P$1
  Top 0.813: C8.1 30.93,37.5 U$1.P$1
N$2
  Top 0.305: MCU1.61 30.85,32.06 31.39,32.6 33.33,32.6 U$1.P$3
  Top 0.813: U$1.P$3 34.31,33.76 C9.1
N$3
  Top 0.406: R2.2 R3.1
  Top 0.61: R2.2 9.76,19.12 U1.8
N$5  (via drill 0.35)
  Top 0.813: v9.93,35.01 LED1.A
  Bottom 0.254: R5.2 9.93,36.12
  Bottom 0.813: v9.93,35.01 R5.2
N$6  (via drill 0.35)
  Top 0.813: v11.96,35.01 LED2.A
  Bottom 0.813: v11.96,35.01 R6.2
N$7  (via drill 0.35)
  Top 0.813: v13.99,35.01 LED3.A
  Bottom 0.813: v13.99,35.01 R7.2
N$10  (via drill 0.35)
  Top 0.813: v7.9,35.01 LED5.A
  Bottom 0.813: v7.9,35.01 R21.2
N$11
  Bottom 0.406: R10.2 R8.2 R9.1 R11.1 10.79,20.45 C20.2
N$12
  Bottom 0.305: R12.2 SERVO_1.3
  Bottom 0.406: SERVO_1.3 C21.2
N$13
  Bottom 0.406: C22.2 SERVO_2.3 43.84,24.73 R13.2
N$14
  Bottom 0.305: SERVO_3.3 42.4,15.37 R14.2
  Bottom 0.406: C23.2 SERVO_3.3
N$15  (via drill 0.35)
  Top 0.305: SERVO_4.3 42.95,2.25 42.31,2.88 v42.31,13.42
  Bottom 0.305: v42.31,13.42 41.81,13.93 41.81,21.3 40.79,22.31 39.99,22.31 R15.2
  Bottom 0.406: C24.2 42.84,2.25 SERVO_4.3
N$16
  Top 0.254: C34.1 8.66,24.73 8.91,24.98 8.91,26.63 9.32,27.04 IC4.2
N$17  (via drill 0.35)
  Top 0.813: v16.03,35.01 LED4.A
  Bottom 0.813: v16.03,35.01 R26.2
N$18
  Top 0.254: C34.2 10.44,24.73 10.62,24.91 IC4.4
N$19
  Top 0.254: C35.1 11.27,25.18 IC4.5
N$20
  Top 0.254: IC4.6 11.92,26.02 C35.2
N$26
  Top 0.254: IC4.3 9.97,26.2 C36.2
N$27
  Top 0.254: IC4.7 12.57,26.78 12.72,26.63 14.23,26.63 C37.2
P0.14  (via drill 0.35)
  Top 0.254: MCU1.41 24.02,23.32 23.01,22.31 22,22.31
  Top 0.305: R22.2 22.63,19.14 21.61,20.15 v21.61,20.28 21.61,21.93 22,22.31
RESET
  Top 0.305: R23.2 33.53,29.95 C33.2 30.9,29.95 30.79,30.06 MCU1.57
RXD0
  Top 0.305: MCU1.21 17.2,31.56 16.79,31.97 14.88,31.97 | 14.88,31.97 13.49,33.36 IC4.9 | 14.88,31.97 14.5,31.97 13.61,31.08 13.61,30.19 13.23,29.81 R27.1
  Top 0.406: R27.1 12.72,29.93
RXD_LT
  Top 0.305: R27.2 10.86,29.72 9.8,28.66
  Top 0.406: SERIAL.3 5.87,26.76 7.77,28.66 9.8,28.66 12.85,28.66 13.22,28.29 IC4.8
SCK
  Top 0.254: SPI.4 37.87,29.3 35.58,27.01 35.58,25.49 33.68,23.58 28.47,23.58 27.96,23.07 27.2,23.07 27.02,23.25 MCU1.47
SCL  (via drill 0.35)
  Top 0.305: MCU1.22 19.35,31.06 19.84,30.57 v19.84,27.27
  Bottom 0.305: R25.2 v19.84,27.27
  Bottom 0.406: I2C.3 19.61,20.4 R25.2
SDA
  Top 0.305: MCU1.26 17.18,29.06 16.66,28.41 16.66,23.2 18.13,21.74 I2C.4
  Bottom 0.406: R1.2 16.67,21.65 I2C.4
SERVO_1  (via drill 0.35)
  Top 0.305: v28.34,35.39 27.54,35.39 MCU1.1
  Bottom 0.305: v28.34,35.39 29.74,35.39 30.5,34.63 R12.1
SERVO_2  (via drill 0.35)
  Top 0.254: MCU1.31 24.33,26.56 v27.71,29.93
  Bottom 0.254: v27.71,29.93 30.94,26.71 35.64,26.71 37.62,24.73 R13.1
SERVO_3  (via drill 0.35)
  Top 0.254: MCU1.33 20.02,25.68 20.47,26.12 24.66,26.12 27.46,28.92 v27.71,28.92
  Bottom 0.254: v27.71,28.92 30.38,26.25 35.33,26.25 37.36,24.22 39.69,24.22 R14.1
SERVO_4  (via drill 0.35)
  Top 0.254: v27.71,27.9 27.07,27.9 24.79,25.61 20.73,25.61 20.52,25.41 MCU1.34
  Bottom 0.254: 37.4,23.29 34.95,25.74 29.87,25.74 v27.71,27.9
  Bottom 0.305: 37.4,23.29 R15.1
SERVOS_GND
  Top 0.813: U$3.P$1 37.34,10.16 U$2.P$4
  Bottom 0.406: C24.1 42.31,6.56 43.08,7.33 SERVO_4.1 C23.1 | 43.47,39.71 SERVO_1.1 43.46,39.71 42.43,38.68 C29.1 | C21.1 SERVO_2.1 43.09,28.92 C30.1 | SERVO_3.1 C22.1
  pour Bottom (isolate 0.406, no thermals): 42.82,40.73 56.54,40.6 56.54,5.93 36.6,6.18 36.6,15.2 41.17,15.2 41.17,8.72 46.89,8.72 46.89,16.85 42.82,16.85 42.82,19.27 46.89,19.27 46.89,27.77 42.95,27.77 42.95,30.19 46.89,30.19 46.89,38.57 42.82,38.44
SERVOS_PWR
  Top 0.305: R19.1 R16.2
  Top 0.813: U$2.P$1 37.82,22.15 R16.2
  Bottom 0.406: SERVO_2.2 44.71,26.39 C30.2 | C29.2 42.55,37.17 SERVO_1.2
  Bottom 1.626: SERVO_1.2 48.47,37.17 C28.+ | SERVO_2.2 48.47,26.38 C25.+ | SERVO_3.2 48.92,15.58 48.92,14.31 48.21,14.31 C26.+ | SERVO_4.2 48.47,4.79 C27.+
  pour Top (no thermals): 52.35,38.44 42.95,38.44 42.95,35.9 46.89,35.9 46.89,27.65 42.95,27.65 42.95,25.11 46.89,25.11 46.89,22.44 36.6,22.44 36.6,16.47 37.11,15.96 41.17,15.96 41.17,19.52 46.89,19.52 46.89,16.73 42.95,16.73 42.95,14.44 46.89,14.44 46.89,5.93 43.08,5.93 43.08,3.64 52.35,3.64
SSEL
  Top 0.254: MCU1.55 35.09,29.06 35.58,29.55 35.58,31.2 37.43,33.05 SPI.7
TXD0
  Top 0.305: 15.18,32.56 MCU1.19 | 15.18,32.56 13.49,34.25 12.22,34.25 11.92,33.96 IC4.11 11.92,32.51 12.56,31.88 R24.1 | 15.18,32.56 15.01,32.73
TXD_LT
  Top 0.305: R24.2 10.79,31.27 10.25,31.27
  Top 0.406: SERIAL.2 8.28,29.3 10.25,31.27 10.62,31.64 IC4.13

### Text on the board
tDocu: PWR | MCU | CAN | MC | ERR | CSC-1.0 | Joby Energy | 09/05 by Poine | SRV_1 | SERIAL | SRV_2 | SPI | CAN | ADC | I2C | SRV_3 | POWER | SRV_4